# EAGLE schematic NewNode (EAGLE 6.1)
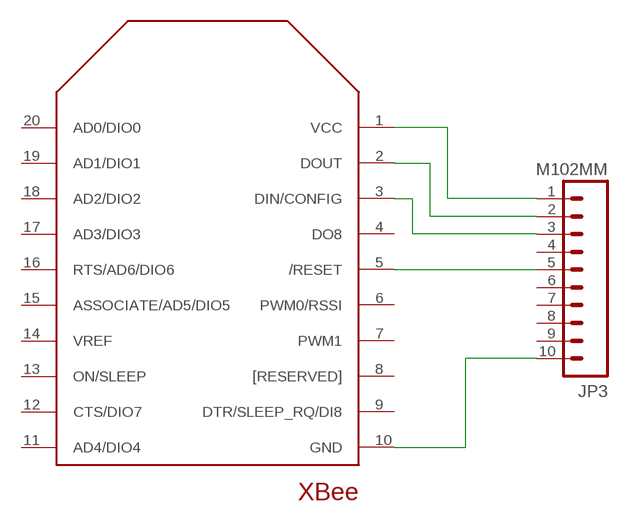
[diagram p0: schematic, sheet 1]

## Parts
JP3  M102MM  [1X10-2MM]
U$2  XBEE  [XBEE]

## Nets
N$18: JP3.1 U$2.1(VCC)
N$19: JP3.2 U$2.2(DOUT)
N$20: JP3.3 U$2.3(DIN/CONFIG)
N$21: JP3.5 U$2.5(/RESET)
N$22: JP3.10 U$2.10(GND)
Unconnected: JP3.4 JP3.6 JP3.7 JP3.8 JP3.9 U$2.4(DO8) U$2.6(PWM0/RSSI) U$2.7(PWM1) U$2.8([RESERVED]) U$2.9(DTR/SLEEP_RQ/DI8) U$2.11(AD4/DIO4) U$2.12(CTS/DIO7) U$2.13(ON/SLEEP) U$2.14(VREF) U$2.15(ASSOCIATE/AD5/DIO5) U$2.16(RTS/AD6/DIO6) U$2.17(AD3/DIO3) U$2.18(AD2/DIO2) U$2.19(AD1/DIO1) U$2.20(AD0/DIO0)

## Library data of the parts
JP3 = SparkFun-Connectors:M10: Header 10 Standard 10-pin 0.1" header. Use with straight break away headers (SKU : PRT-00116), right angle break away headers (PRT-00553), swiss pins (PRT-00743), machine pins (PRT-00117), and female headers (PRT-00115).
U$2 = CEDT:XBEE